# EAGLE schematic intercon (EAGLE 6.6.0)
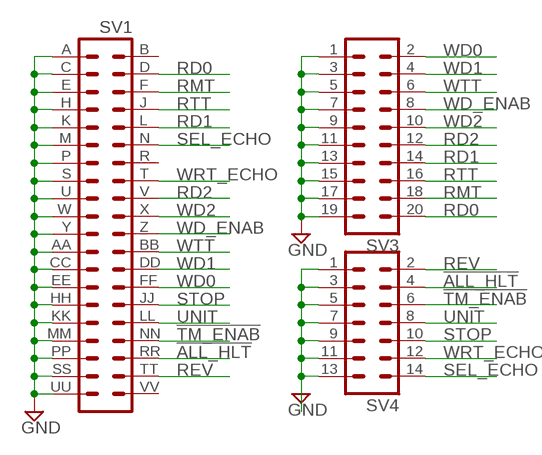
[diagram p0: schematic, sheet 1]

## Parts
SV1  DEC40PINV  [DEC40PINV]
SV3  MA10-2  [MA10-2]
SV4  MA07-2  [MA07-2]

## Nets
!ALL_HLT: SV1.RR SV4.4
!TM_ENAB: SV1.NN SV4.6
GND: SV1.A SV1.AA SV1.C SV1.CC SV1.E SV1.EE SV1.H SV1.HH SV1.K SV1.KK SV1.M SV1.MM SV1.P SV1.PP SV1.S SV1.SS SV1.U SV1.UU SV1.W SV1.Y SV3.1 SV3.3 SV3.5 SV3.7 SV3.9 SV3.11 SV3.13 SV3.15 SV3.17 SV3.19 SV4.1 SV4.3 SV4.5 SV4.7 SV4.9 SV4.11 SV4.13
RD0: SV1.D SV3.20
RD1: SV1.L SV3.14
RD2: SV1.V SV3.12
REV: SV1.TT SV4.2
RMT: SV1.F SV3.18
RTT: SV1.J SV3.16
SEL_ECHO: SV1.N SV4.14
STOP: SV1.JJ SV4.10
UNIT: SV1.LL SV4.8
WD0: SV1.FF SV3.2
WD1: SV1.DD SV3.4
WD2: SV1.X SV3.10
WD_ENAB: SV1.Z SV3.8
WRT_ECHO: SV1.T SV4.12
WTT: SV1.BB SV3.6
Unconnected: SV1.B SV1.R SV1.VV

## Library data of the parts
SV1 = dec-con:DEC40PIN: PIN HEADER
SV3 = con-lstb:MA10-2: PIN HEADER; OC_FARNELL: unknown; OC_NEWARK: unknown
SV4 = con-lstb:MA07-2: PIN HEADER; OC_FARNELL: unknown; OC_NEWARK: unknown